# EAGLE schematic tax fraud 2 (EAGLE 9.6.2)
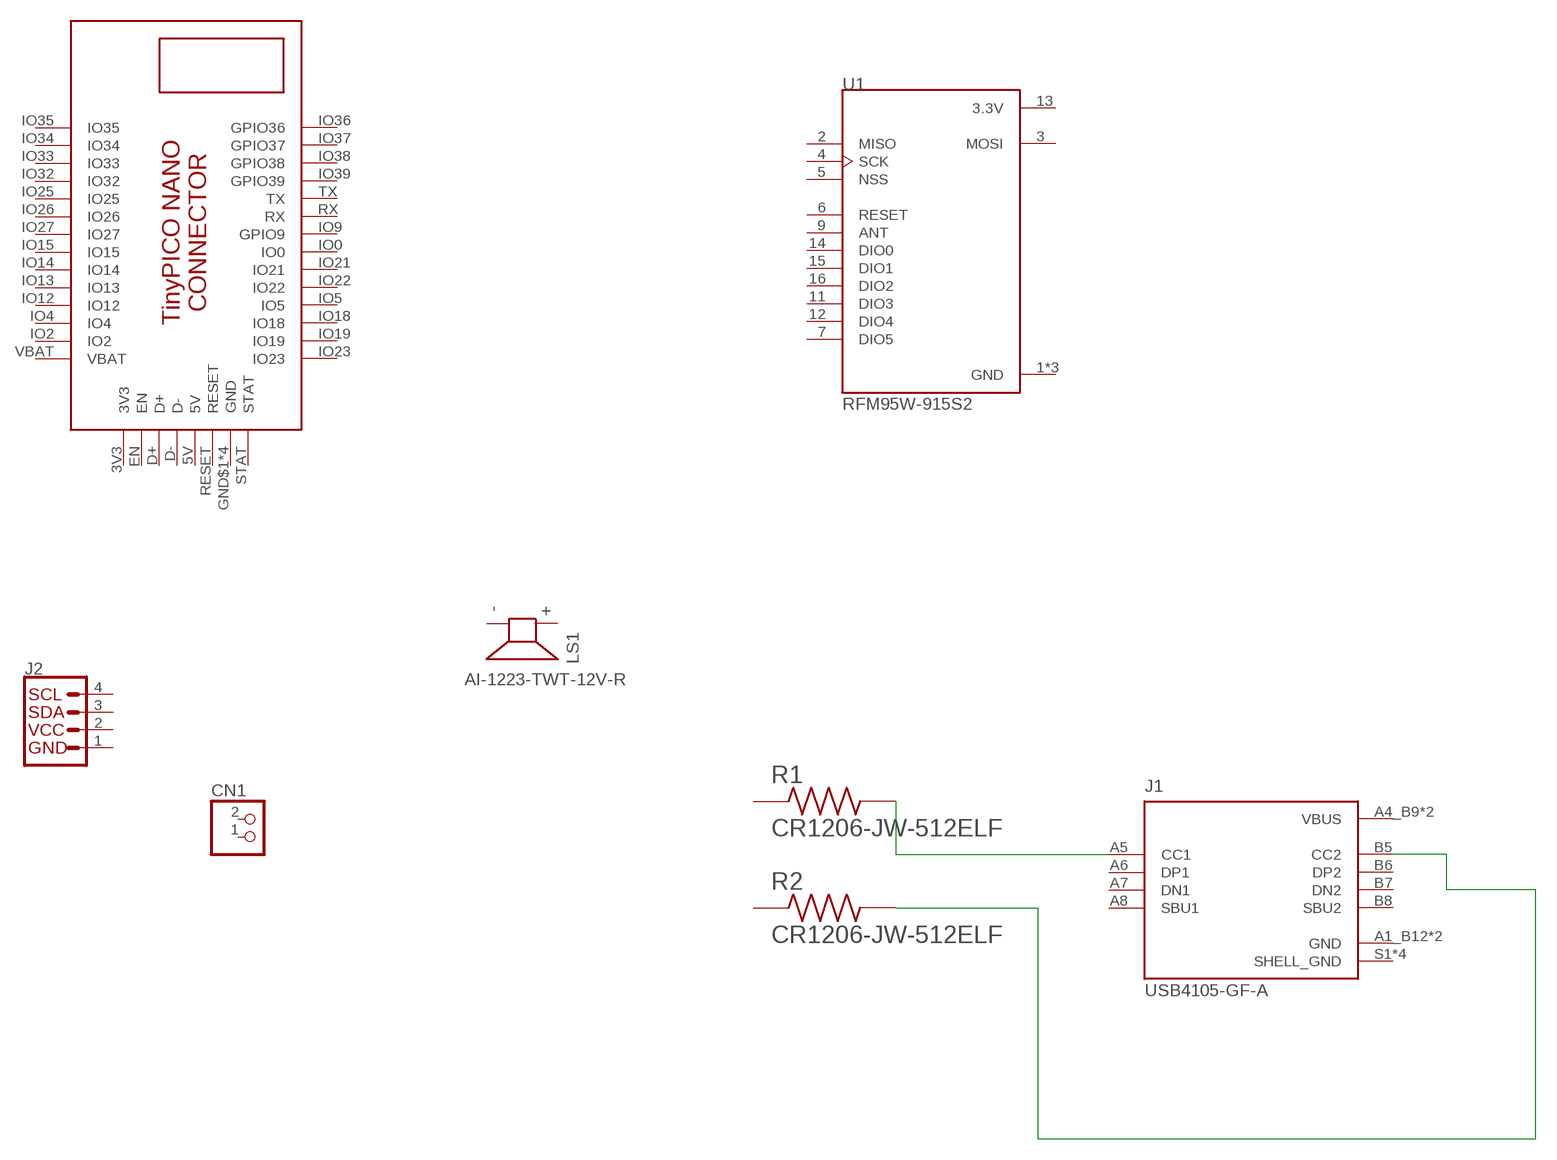
[diagram p0: schematic, sheet 1]

## Parts
CN1  JST_2PIN-SMT-RA  [JST-PH-2-SMT-RA]
J1  USB4105-GF-A  [GCT_USB4105-GF-A]
J2  QWIIC_CONNECTORJS-1MM  [1X04_1MM_RA]
LS1  AI-1223-TWT-12V-R  [XDCR_AI-1223-TWT-12V-R]
R1  CR1206-JW-512ELF  [RESC3216X75N]
R2  CR1206-JW-512ELF  [RESC3216X75N]
U1  RFM95W-915S2  [XCVR_RFM95W-915S2]
U$1  TINYPICO-NANO-CONNECTOR  [TINYPICO-NANO-CONNECTOR]

## Nets
N$1: J1.A5(CC1) R1.2
N$2: J1.B5(CC2) R2.2
Unconnected: CN1.1 CN1.2 J1.A6(DP1) J1.A7(DN1) J1.A8(SBU1) J1.B6(DP2) J1.B7(DN2) J1.B8(SBU2) J2.3(SDA) J2.4(SCL) LS1.N(-) LS1.P(+) R1.1 R2.1 U1.2(MISO) U1.3(MOSI) U1.4(SCK) U1.5(NSS) U1.6(RESET) U1.7(DIO5) U1.9(ANT) U1.11(DIO3) U1.12(DIO4) U1.14(DIO0) U1.15(DIO1) U1.16(DIO2) U$1.D+ U$1.D- U$1.EN U$1.IO0 U$1.IO2 U$1.IO4 U$1.IO5 U$1.IO9(GPIO9) U$1.IO12 U$1.IO13 U$1.IO14 U$1.IO15 U$1.IO18 U$1.IO19 U$1.IO21 U$1.IO22 U$1.IO23 U$1.IO25 U$1.IO26 U$1.IO27 U$1.IO32 U$1.IO33 U$1.IO34 U$1.IO35 U$1.IO36(GPIO36) U$1.IO37(GPIO37) U$1.IO38(GPIO38) U$1.IO39(GPIO39) U$1.RESET U$1.RX U$1.STAT U$1.TX

## Power pins joined to a net without a drawn wire
3.3V: U1.13(3.3V)
3V3: U$1.3V3
5V: U$1.5V
GND: J1.A1_B12(GND) J1.B1_A12(GND) J2.1(GND) U1.1(GND) U1.8(GND) U1.10(GND) U$1.GND$1(GND) U$1.GND$2(GND) U$1.GND$3(GND) U$1.GND$4(GND)
SHELL_GND: J1.S1(SHELL_GND) J1.S2(SHELL_GND) J1.S3(SHELL_GND) J1.S4(SHELL_GND)
VBAT: U$1.VBAT
VBUS: J1.A4_B9(VBUS) J1.B4_A9(VBUS)
VCC: J2.2(VCC)

## Library data of the parts
CN1 = adafruit:JST_2PIN: JST 2-Pin Connectors of various flavors SMT-RA (S2B-PH-SM4) 4UConnector #17311 SMT (B2B-PH-SM4) THM-RA (S2B-PH) THM (B2B-PH)
J1 = USB-C Adafruit USB4105-GF-A:USB4105-GF-A: USB-C (USB TYPE-C) USB 2.0 Receptacle Connector 24 (16+8 Dummy) Position Surface Mount, Right Angle; Through Hole; DESCRIPTION: USB-C (USB TYPE-C) USB 2.0 Receptacle Connector 24 (16+8 Dummy) Position Surface Mount, Right Angle; Through Hole; DIGI-KEY_PART_NUMBER: 2073-USB4105-GF-ATR-ND; MF: GCT; MP: USB4105-GF-A; PACKAGE: None; PURCHASE-URL: https://pricing.snapeda.com/search/part/USB4105-GF-A/?ref=eda
J2 = SparkFun-Connectors:QWIIC_CONNECTOR: SparkFun I2C Standard Qwiic Connector An SMD 1mm pitch JST connector makes it easy and quick (get it? Qwiic?) to connect I2C devices to each other. The Qwiic system <http://www.sparkfun.com/qwiic> enables fast and solderless connection between popular platforms and various sensors and actuators. We carry 200mm <https://www.sparkfun.com/products/14204>, 100mm <https://www.sparkfun.com/products/14205>, 50mm <https://www.sparkfun.com/products/14206>, and breadboard friendly <https://www.sparkfun.com/products/14207> Qwiic cables. We also offer 10 pcs strips <https://www.sparkfun.com/products/14323> the SMD connectors.
LS1 = buzzer:AI-1223-TWT-12V-R: Check availability <https://pricing.snapeda.com/parts/AI-1223-TWT-12V-R/PUI%20Audio%2C/view-part?ref=eda>; AVAILABILITY: In Stock; DESCRIPTION: ELECTRO-MECHANICAL AUDIO INDICATOR; MF: PUI Audio,; MP: AI-1223-TWT-12V-R; PACKAGE: None; PRICE: None; PURCHASE-URL: https://pricing.snapeda.com/search/part/AI-1223-TWT-12V-R/?ref=eda
R1 R2 = resis CR1206-JW-512ELF:CR1206-JW-512ELF: RES SMD 5.1K OHM 5% 1/4W 1206; DESCRIPTION: 5.1 kOhms ±5% 0.25W, 1/4W Chip Resistor 1206 (3216 Metric) Moisture Resistant Thick Film; DIGI-KEY_PART_NUMBER: 118-CR1206-JW-512ELFTR-ND; MF: Bourns; MP: CR1206-JW-512ELF; PACKAGE: 3216 Bourns; PURCHASE-URL: https://pricing.snapeda.com/search/part/CR1206-JW-512ELF/?ref=eda
U1 = RFM95W-915S2:RFM95W-915S2: RFM95(W) - Low Power Long Range Transceiver Module V1.0 Check availability <https://pricing.snapeda.com/parts/RFM95W-915S2/RF%20Solutions/view-part?ref=eda>; AVAILABILITY: In Stock; DESCRIPTION: 802.15.4 LoRa™ Transceiver Module 915MHz Antenna Not Included Surface Mount; MF: RF Solutions; MP: RFM95W-915S2; PACKAGE: Non Standard RF Solutions; PRICE: None; PURCHASE-URL: https://pricing.snapeda.com/search/part/RFM95W-915S2/?ref=eda
U$1 = TinyPICO_NANO_Eagle:TINYPICO-NANO-CONNECTOR: TinyPICO NANO Footprint https://www.tinypico.com/tinypico-nano